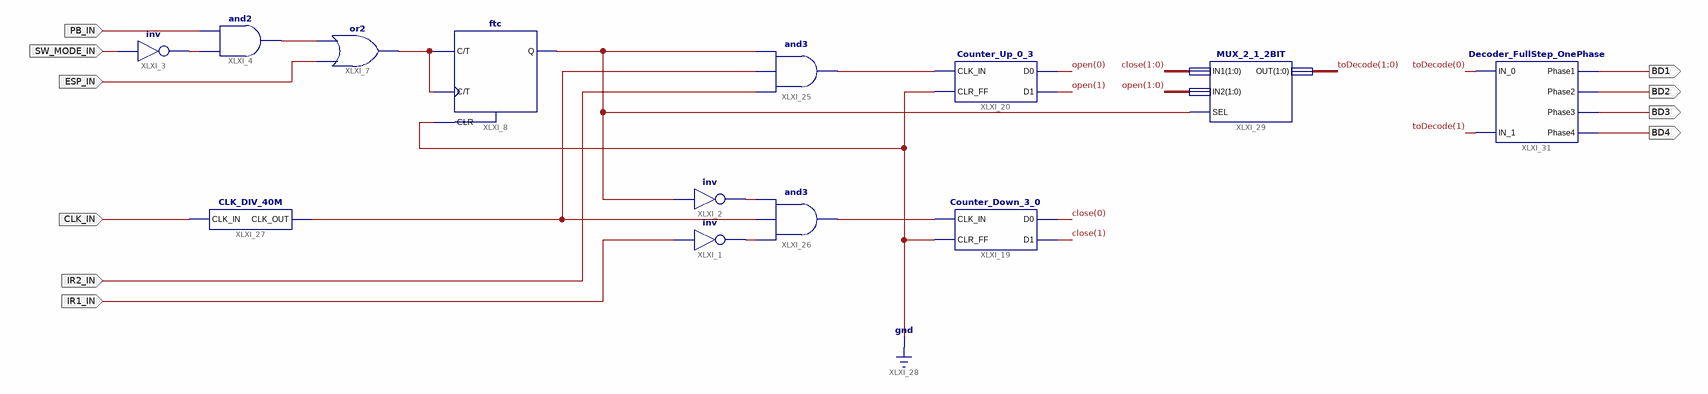
[diagram p0: schematic sheet 1]
// Xilinx ISE schematic GarageDoor.sch (spartan6) as structural Verilog: 13 symbols, 10 ports
module GarageDoor (
  input  CLK_IN,
  input  IR1_IN,
  input  IR2_IN,
  input  ESP_IN,
  input  SW_MODE_IN,
  input  PB_IN,
  output BD4,
  output BD3,
  output BD2,
  output BD1
);

  wire XLXN_1, XLXN_6, XLXN_8, XLXN_15, XLXN_16, XLXN_20, XLXN_21, XLXN_22, XLXN_33;
  wire [1:0] close, open, toDecode;

  Decoder_FullStep_OnePhase XLXI_31 (
    .IN_0(toDecode[0]), .IN_1(toDecode[1]), .Phase1(BD1), .Phase2(BD2), .Phase3(BD3), .Phase4(BD4));
  MUX_2_1_2BIT XLXI_29 (.IN1(close), .IN2(open), .SEL(XLXN_33), .OUT(toDecode));
  CLK_DIV_40M XLXI_27 (.CLK_IN(CLK_IN), .CLK_OUT(XLXN_22));
  not XLXI_1 (XLXN_21, IR1_IN);
  not XLXI_2 (XLXN_20, XLXN_33);
  and XLXI_25 (XLXN_15, IR2_IN, XLXN_22, XLXN_33);
  and XLXI_26 (XLXN_16, XLXN_21, XLXN_22, XLXN_20);
  Counter_Up_0_3 XLXI_20 (.CLK_IN(XLXN_15), .CLR_FF(1'b0), .D0(open[0]), .D1(open[1]));
  Counter_Down_3_0 XLXI_19 (.CLK_IN(XLXN_16), .CLR_FF(1'b0), .D0(close[0]), .D1(close[1]));
  ftc XLXI_8 (.C(XLXN_8), .CLR(1'b0), .T(XLXN_8), .Q(XLXN_33));
  or XLXI_7 (XLXN_8, ESP_IN, XLXN_6);
  not XLXI_3 (XLXN_1, SW_MODE_IN);
  and XLXI_4 (XLXN_6, XLXN_1, PB_IN);
endmodule
